# EAGLE design RTC Board (EAGLE 7.7.0)
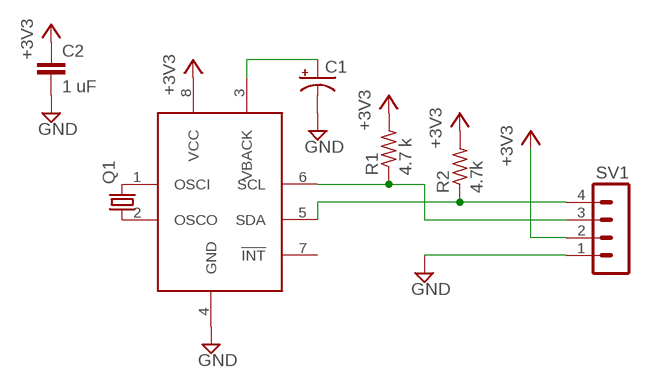
[diagram p0: schematic, sheet 1]

## Parts
C1  CPOL-US150CLZ-1010  [150CLZ-1010]
C2  1 uF  C-EUC1206  [C1206]
Q1  CRYSTALTC26H  [TC26H]
R1  4.7 k  R-US_R1206  [R1206]
R2  4.7k  R-US_R1206  [R1206]
SV1  MA04-1  [MA04-1]
U$1  BQ32000  [SOIC8]

## Nets
+3V3: C2.1 R1.2 R2.2 SV1.2 U$1.8(VCC)
GND: C1.- C2.2 SV1.1 U$1.4(GND)
N$1: C1.+ U$1.3(VBACK)
N$2: Q1.2 U$1.1(OSCI)
N$3: Q1.1 U$1.2(OSCO)
N$4: R1.1 SV1.3 U$1.6(SCL)
N$5: R2.1 SV1.4 U$1.5(SDA)
Unconnected: U$1.7(!INT)

## Library data of the parts
C1 = resistor:CPOL-US: POLARIZED CAPACITOR, American symbol
C2 = resistor:C-EU: CAPACITOR, European symbol
Q1 = crystal:CRYSTAL: CRYSTAL; OC_FARNELL: unknown; OC_NEWARK: unknown
R1 R2 = resistor:R-US_: RESISTOR, American symbol
SV1 = con-lstb:MA04-1: PIN HEADER; OC_FARNELL: unknown; OC_NEWARK: unknown
U$1 = FRC696:BQ32000

## Board
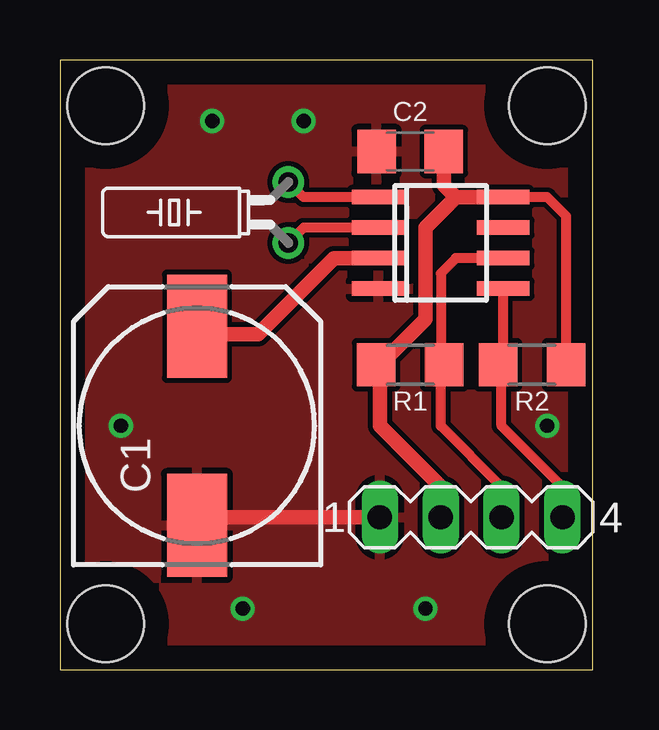
[diagram p1: board, top side]
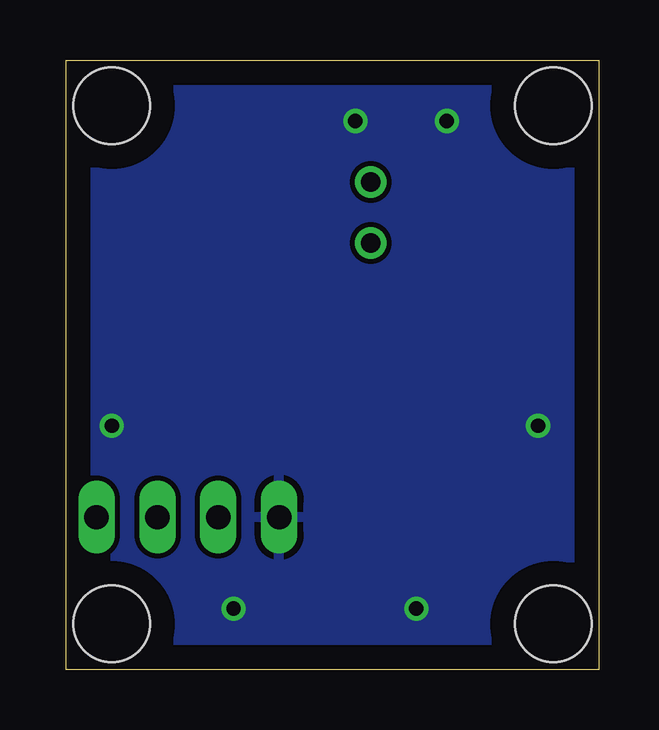
[diagram p2: board, bottom side, seen from below]

Size 22.23 x 25.4 mm. Coordinates in mm from the lower left corner, seen from the top.
Outline: 0,0 22.23,0 22.23,25.4 0,25.4 0,0
Copper layers (1*16): Top 0.035mm / dielectric 1.5mm / Bottom 0.035mm
Design rules "default": minimum track width 10mil, minimum drill 24mil, track to track 8mil, track to pad 8mil, pad to pad 8mil, via to via 8mil, smd to smd 8mil, copper to edge 40mil, drill to drill 8mil, minimum pad ring 10mil, minimum via ring 8mil, stop-mask expansion 4mil, vias tented up to drill 0mil, thermal gap 10mil
Holes 3.2 mm at 1.91,1.91 20.32,1.91 1.91,23.5 20.32,23.5

### Footprints (pad centres in the part's own frame; a part is rotated, then mirrored left to right if it is on the bottom)
150CLZ-1010 = smd 4.3 x 2.5: + 4.15,0; - -4.15,0
C1206 = smd 1.6 x 1.8: 1 -1.4,0; 2 1.4,0
TC26H = drill 0.813: 1 -1.27,0; 2 1.27,0
R1206 = smd 1.6 x 1.803: 1 -1.422,0; 2 1.422,0
MA04-1 = drill 1.016 long: 1 -3.81,0; 2 -1.27,0; 3 1.27,0; 4 3.81,0
SOIC8 = smd 0.6 x 2.2: 1 -1.905,-2.6; 2 -0.635,-2.6; 3 0.635,-2.6; 4 1.905,-2.6; 5 1.905,2.6; 6 0.635,2.6; 7 -0.635,2.6; 8 -1.905,2.6

### Placement (x,y rotation side)
C1  5.71,10.16 90 top
C2  14.61,21.59 180 top
Q1  9.53,19.05 90 top
R1  14.61,12.7 180 top
R2  19.68,12.7 0 top
SV1  17.14,6.35 0 top
U$1  15.88,17.78 270 top

### Tracks (layer width: path | path; a pad name or v marks a point on that pad's centre or on a via)
+3V3
  Top 0.406: R2.2 21.11,18.9 20.32,19.68 U$1.8
  Top 0.61: SV1.2 15.88,7.62 13.34,10.16 13.34,12.55 R1.2 13.34,12.7 15.24,14.61 15.24,18.41 16.51,19.68 | 16.51,19.68 U$1.8 | C2.1 16,20.19 16.51,19.68
GND  (via drill 0.6)
  Top 0.61: SV1.1 6.05,6.35 C1.-
  other vias: 7.62,2.54 15.24,2.54 2.54,10.16 20.32,10.16 10.16,22.86 6.35,22.86
  pour Bottom: -3.81,29.21 -3.81,-1.27 24.13,-1.27 24.13,29.21
  pour Top: -5.08,30.48 -5.08,-2.54 25.4,-2.54 25.4,30.48
N$1
  Top 0.61: U$1.3 11.43,17.14 8.26,13.97 6.05,13.97 C1.+
N$2
  Top 0.406: U$1.1 10.16,19.68 Q1.2
N$3
  Top 0.406: U$1.2 10.16,18.41 Q1.1
N$4
  Top 0.406: U$1.6 16.51,17.14 15.88,16.51 15.88,12.85 R1.1 15.88,12.55 15.88,10.16 18.41,7.62 SV1.3
N$5
  Top 0.406: U$1.5 18.48,12.91 R2.1 18.41,12.55 18.41,10.16 20.95,7.62 SV1.4